# Altium schematic sheet UART_Error_Handling.SchDoc
size A; DocumentNumber: 1; SheetNumber: 1; SheetTotal: 1
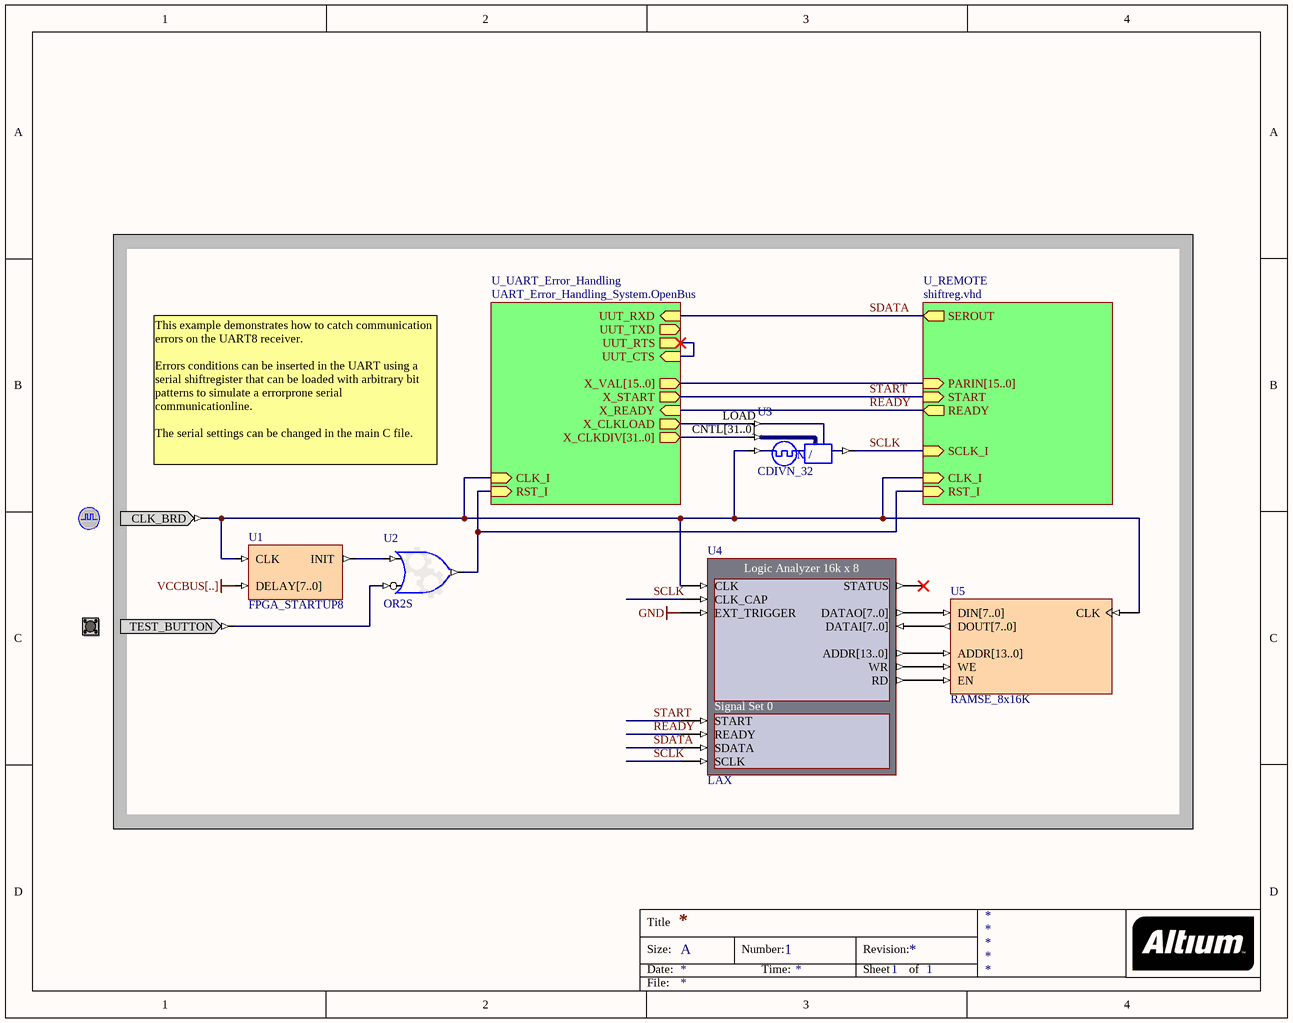
[diagram p0: UART_Error_Handling.SchDoc]

## Parts
(Parts that share a designator on the sheet are numbered #1, #2 ... from top to bottom, then left to right.)
?#1  CLOCK_BOARD  (value not drawn)
?#2  TEST_BUTTON  (value not drawn)
U1  FPGA_STARTUP8
U2  OR2S
U3  CDIVN_32
U4  LAX
U5  RAMSE_8x16K

## Sub-sheets
U_REMOTE = shiftreg.vhd: PARIN[15..0] (in), START (in), READY (out), SEROUT (out), SCLK_I (in), RST_I (in), CLK_I (in)
U_UART_Error_Handling = UART_Error_Handling_System.OpenBus: RST_I (in), CLK_I (in), UUT_TXD (out), UUT_RXD (in), UUT_CTS (in), UUT_RTS (out), X_VAL[15..0] (out), X_START (out), X_READY (in), X_CLKDIV[31..0] (out), X_CLKLOAD (out)

## Nets
GND: U4.EXT_TRIGGER
GND_BUS[3..0]: U4.Set0_Spare[3..0]
VCCBUS[..]: U1.DELAY[7..0]
READY: U4.READY ; sheet U_UART_Error_Handling/X_READY, sheet U_REMOTE/READY
SCLK: U3.CLKDV U4.CLK_CAP U4.SCLK ; sheet U_REMOTE/SCLK_I
SDATA: U4.SDATA ; sheet U_UART_Error_Handling/UUT_RXD, sheet U_REMOTE/SEROUT
START: U4.START ; sheet U_UART_Error_Handling/X_START, sheet U_REMOTE/START
Net?#1_CLK_BRD: ?#1.CLK_BRD U1.CLK U3.CLKIN U4.CLK U5.CLK ; sheet U_UART_Error_Handling/CLK_I, sheet U_REMOTE/CLK_I
Net?#2_TEST_BUTTON: ?#2.TEST_BUTTON U2.I1
NetU1_INIT: U1.INIT U2.I0
NetU2_O: U2.O ; sheet U_UART_Error_Handling/RST_I, sheet U_REMOTE/RST_I
NetU3_CNTL[31..0]: U3.CNTL[31..0] ; sheet U_UART_Error_Handling/X_CLKDIV[31..0]
NetU3_LOAD: U3.LOAD ; sheet U_UART_Error_Handling/X_CLKLOAD
NetU4_ADDR[13..0]: U4.ADDR[13..0] U5.ADDR[13..0]
NetU4_DATAI[7..0]: U4.DATAI[7..0] U5.DOUT[7..0]
NetU4_DATAO[7..0]: U4.DATAO[7..0] U5.DIN[7..0]
NetU4_RD: U4.RD U5.EN
NetU4_WR: U4.WR U5.WE
(unnamed): sheet U_UART_Error_Handling/UUT_CTS, sheet U_UART_Error_Handling/UUT_RTS

Not connected (* = marked no-connect by the designer): U4 STATUS*

## Buses and harness runs
bus sheet U_REMOTE/PARIN[15..0] = sheet U_UART_Error_Handling/X_VAL[15..0]

## Notes on the sheet
- This example demonstrates how to catch communication errors on the UART8 receiver.
  Errors conditions can be inserted in the UART using a serial shiftregister that can be loaded with arbitrary bit patterns to simulate a errorprone serial communicationline.
  The serial settings can be changed in the main C file.
- Title
- Size:
- Date:
- A
- Number:
- Time:
- Revision:
- Sheet
- of
- File:
- (in symbol CDIVN_32) / N
- (in symbol LAX) Logic Analyzer 16k x 8; Signal Set 0

## Library data of the parts
?#1 = CLOCK_BOARD: Global System Clock Supply; PortComponent: True; Published: 19-Nov-2003; Publisher: Altium Limited; HelpURL: TR0143 Technical Reference Manual for Altium's Desktop NanoBoard NB2DSK01.pdf#page=41; UseInDSF: True
?#2 = TEST_BUTTON: Test / Reset Button; PortComponent: True; Published: 19-Nov-2003; Publisher: Altium Limited; HelpURL: TR0143 Technical Reference Manual for Altium's Desktop NanoBoard NB2DSK01.pdf#page=53
U1 = FPGA_STARTUP8: FPGA Startup With 8 Bit Delay; Published: 9-Dec-2004; Publisher: Altium Limited; HelpURL: CR0119 FPGA_STARTUPx Powerup Delay Unit.pdf; LastRevisionNo: 1.00.00; ComponentLink1Description: Core &Resource Usage; ComponentLink1URL: CR0139 FPGA Peripheral Resource Usage.pdf#page=11
U2 = GATE: Configurable Generic Gate; ConfiguratorName: GENERIC_GATE; ConfigurationParameters: {}Version[1.0]{}GateKind[OR]{}BusInput[False]{}GateInputType[Bit]{}GateOutputOption[Normal]{}BusWidth[8]{}RegisterOutputs[False]{}NegativeClockEdge[False]{}InputCount[2]{}InputInvert0[False]{}InputInvert1[True]{}; LastRevisionNo: 1.00.00; Published: 3-Sep-2008; Publisher: Altium Limited
U3 = CDIVN_32: 32-Bit Programmable Clock Divider; PortSize: 32; ArchiveName: GENERIC; VHDLIB_SIM: GENERIC_LIB; Published: 29-Jan-2004; Publisher: Altium Limited; LastRevisionNo: 1.00.00; HelpURL: CR0118 FPGA Generic Library Guide.pdf#page=144; ComponentLink1URL: CR0127 FPGA Clock Divider Resource Usage.pdf#page=34; ComponentLink1Description: Core &Resource Usage; FunctionalClass: Clock Divider; DivisorRate: Programmable
U4 = LAX: Configurable Logic Analyzer; NEXUS_CORE: Instrument; NEXUS_JTAG_DEVICE: True; NEXUS_JTAG_ORDER: 0; ConfiguratorName: LogicAnalyser; ConfigurationParameters: {}Version[1.0]{}CaptureWidth[8]{}MemorySize[ExternalMemory]{}ExtAddrWidth[14]{}Set0[Signal Set 0]{}Set0_Signal0[START]{}Style_Set0_Signal0[Default]{}Set0_Signal1[READY]{}Style_Set0_Signal1[Default]{}Set0_Signal2[SDATA]{}Style_Set0_Signal2[Default]{}Set0_Signal3[SCLK]{}Style_Set0_Signal3[Default]{}ConnectSpareToGND[True]{}; ChildModel1: LAX_CFG8; Published: 12-Oct-2005; Publisher: Altium Limited; Core Revision: 1.00.00; HelpURL: https://wiki.altium.com/display/ADOH/Logic+Analyzer; LastRevisionNo: 1.00.00; ComponentLink1Description: Core &Resource Usage; ComponentLink1URL: CR0134 FPGA Instrument Resource Usage.pdf#page=10
U5 = RAMSE_8x16K: Single Port RAM, Enable; Memory_Depth: 16384; Memory_Type: RAM_SinglePortBlock; Memory_Width: 8; Memory_ClockEdge: Rising; Nexus_Core: Memory_Program; Memory_EnablePin: True; Memory_ByteWrites: False; Published: 11/10/2004; Publisher: Altium Hobart Technology Center